# EAGLE design test_baro_24 (EAGLE 6.1)
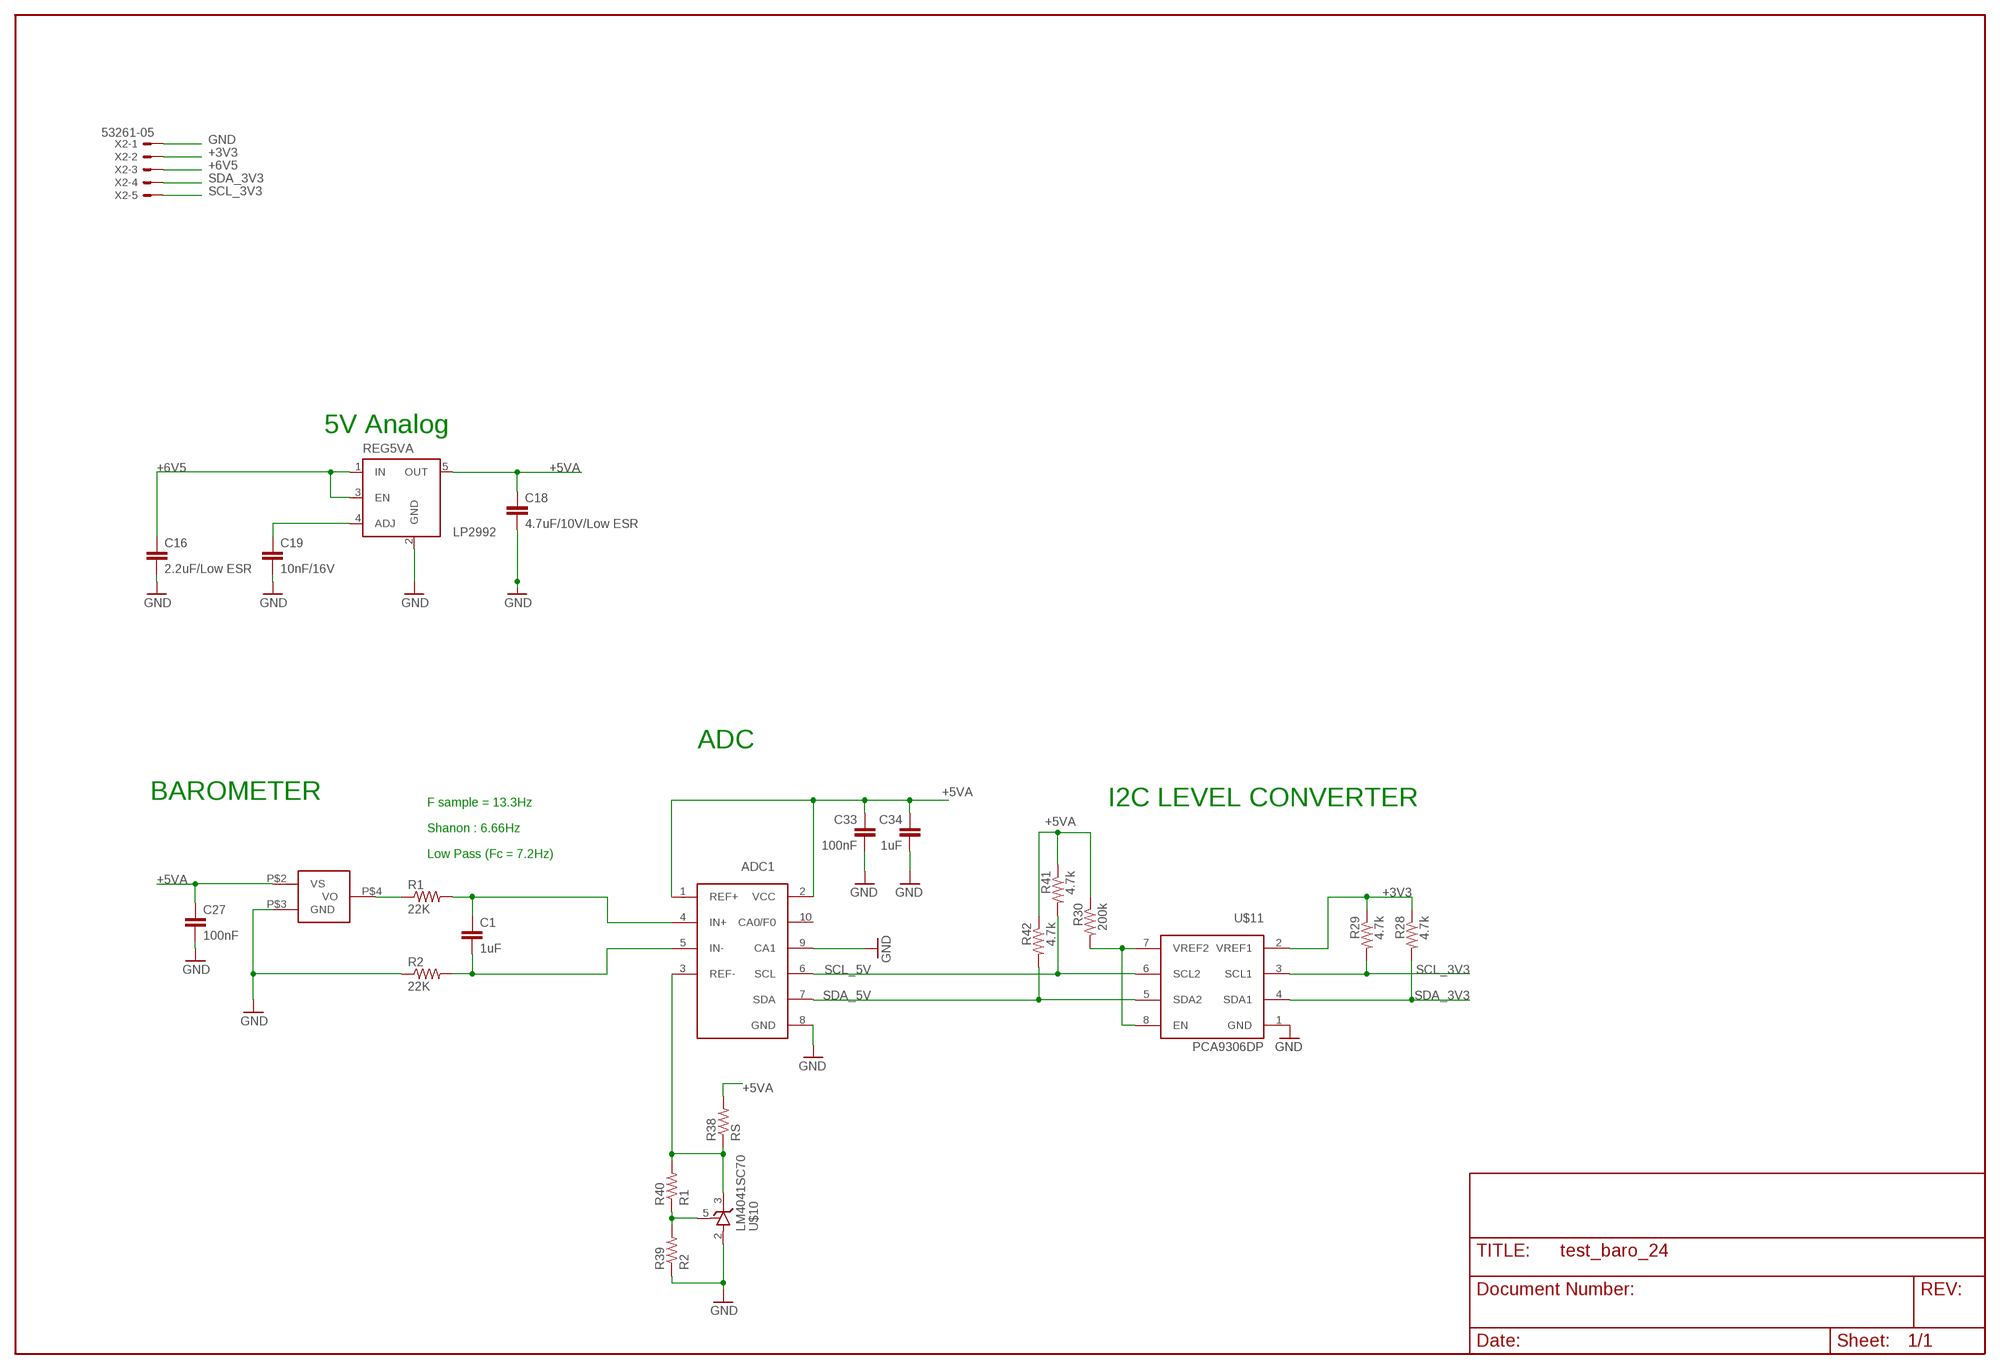
[diagram p0: schematic, sheet 1]

## Parts
ADC1  LTC2485  [DFN10]
C1  1uF  C-EUC1206K  [C1206K]
C16  2.2uF/Low ESR  C-EUC0603  [C0603]
C18  4.7uF/10V/Low ESR  C-EUC0805K  [C0805K]
C19  10nF/16V  C-EUC0603K  [C0603K]
C27  100nF  C-EUC0603  [C0603]
C33  100nF  C-EUC0603  [C0603]
C34  1uF  C-EUC0805  [C0805]
R1  22K  R-US_R0603  [R0603]
R2  22K  R-US_R0603  [R0603]
R28  4.7k  R-US_R0603  [R0603]
R29  4.7k  R-US_R0603  [R0603]
R30  200k  R-US_R0603  [R0603]
R38  RS  R-US_R0603  [R0603]
R39  R2  R-US_R0603  [R0603]
R40  R1  R-US_R0603  [R0603]
R41  4.7k  R-US_R0603  [R0603]
R42  4.7k  R-US_R0603  [R0603]
REG5VA  LP2992  MIC5219BM5  [SOT23-5]
U$2  MPX6115  [CASE_1317]
U$10  LM4041SC70  [SC70-5L]
U$11  PCA9306DP  [TSSOP_B3]
X2  53261-05  [53261-05]

## Nets
+3V3: R28.1 R29.1 U$11.2(VREF1) X2.2
+5VA: ADC1.1(REF+) ADC1.2(VCC) C18.1 C27.1 C33.1 C34.1 R30.1 R38.2 R41.1 R42.1 REG5VA.5(OUT) U$2.P$2(VS)
+6V5: C16.1 REG5VA.1(IN) REG5VA.3(EN) X2.3
GND: ADC1.8(GND) ADC1.9(CA1) C16.2 C18.2 C19.2 C27.2 C33.2 C34.2 R2.1 R39.1 REG5VA.2(GND) U$2.P$3(GND) U$10.2(A) U$11.1(GND) X2.1
N$1: R1.1 U$2.P$4(VO)
N$2: ADC1.4(IN+) C1.1 R1.2
N$4: ADC1.5(IN-) C1.2 R2.2
N$11: R30.2 U$11.7(VREF2) U$11.8(EN)
N$18: R39.2 R40.1 U$10.5(R)
N$23: C19.1 REG5VA.4(ADJ)
N$27: ADC1.3(REF-) R38.1 R40.2 U$10.3(C)
SCL_3V3: R29.2 U$11.3(SCL1) X2.5
SCL_5V: ADC1.6(SCL) R41.2 U$11.6(SCL2)
SDA_3V3: R28.2 U$11.4(SDA1) X2.4
SDA_5V: ADC1.7(SDA) R42.2 U$11.5(SDA2)
Unconnected: ADC1.10(CA0/F0)

## Notes on the sheet
- 5V Analog
- ADC
- BAROMETER
- F sample = 13.3Hz | I2C LEVEL CONVERTER
- Shanon : 6.66Hz
- Low Pass (Fc = 7.2Hz)

## Library data of the parts
ADC1 = booz:LTC2485: 24-Bit ADC With Easy Drive, Input Current Cancellation and I2C Interface
C1 C16 C18 C19 C27 C33 C34 = rcl:C-EU: CAPACITOR, European symbol
R1 R2 R28-R30 R38-R42 = rcl:R-US_: RESISTOR, American symbol
REG5VA = v-reg-micrel:MIC5219BM5: VOLTAGE REGULATOR
U$2 = booz:MPX6115
U$10 = booz:LM4041: Precision Micropower Shunt Voltage Reference
U$11 = booz:PCA9306: Dual bidirectional I2C-bus and SMBus voltage-level translator
X2 = con-molex:53?-05: CONNECTOR wire to board 1.25 mm (.049 inch) pitch header

## Board
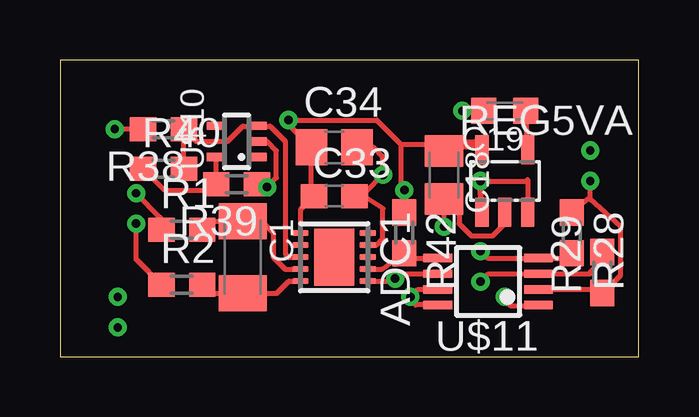
[diagram p1: board, top side]
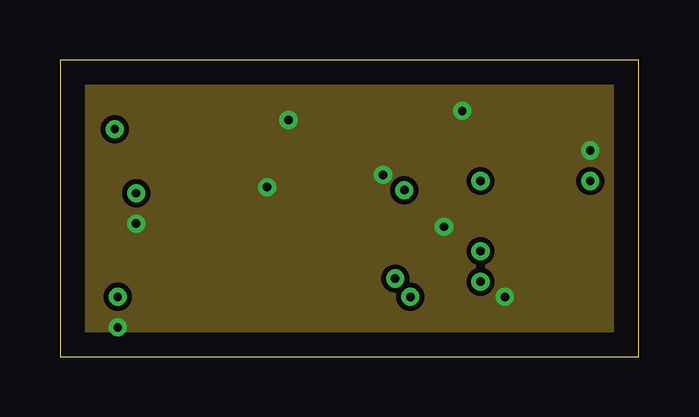
[diagram p2: board, inner layer Route2]
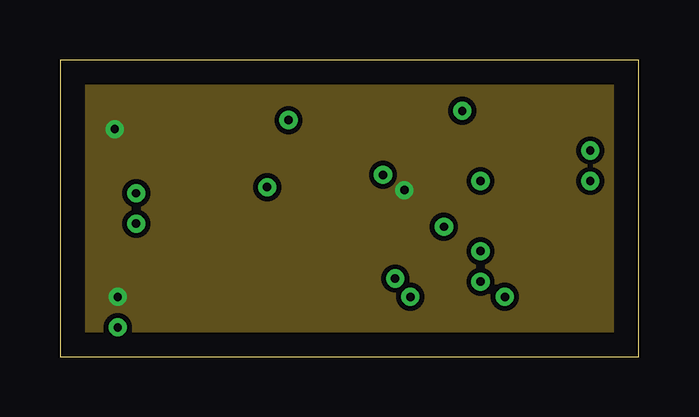
[diagram p3: board, inner layer Route15]
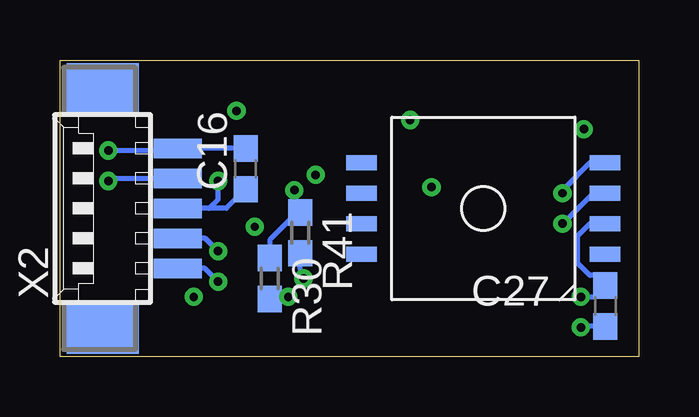
[diagram p4: board, bottom side, seen from below]

Size 24.11 x 12.37 mm. Coordinates in mm from the lower left corner, seen from the top.
Outline: 0,0 24.11,0 24.11,12.37 0,12.37 0,0
Copper layers (1*16): Top 0.035mm / dielectric 1.5mm / Bottom 0.035mm
Design rules: minimum track width 10mil, minimum drill 24mil, track to track 8mil, track to pad 8mil, pad to pad 8mil, via to via 8mil, smd to smd 8mil, copper to edge 40mil, drill to drill 8mil, minimum pad ring 10mil, minimum via ring 8mil, stop-mask expansion 4mil, vias tented up to drill 0mil, thermal gap 10mil

### Footprints (pad centres in the part's own frame; a part is rotated, then mirrored left to right if it is on the bottom)
DFN10 = smd 0.25 x 0.675: 1 -1,-1.4; 2 -0.5,-1.4; 3 0,-1.4; 4 0.5,-1.4; 5 1,-1.4; 6 1,1.4; 7 0.5,1.4; 8 0,1.4; 9 -0.5,1.4; 10 -1,1.4 | smd 2.38 x 1.65: 11 0,0
C1206K = smd 1.5 x 2: 1 -1.5,0; 2 1.5,0
C0603 = smd 1.1 x 1: 1 -0.85,0; 2 0.85,0
C0805K = smd 1.3 x 1.6: 1 -1,0; 2 1,0
C0603K = smd 1.05 x 1.08: 1 -0.875,0; 2 0.875,0
C0805 = smd 1.3 x 1.5: 1 -0.95,0; 2 0.95,0
R0603 = smd 1.1 x 1: 1 -0.85,0; 2 0.85,0
SOT23-5 = smd 0.55 x 1.2: 1 -0.95,-1.3; 2 0,-1.3; 3 0.95,-1.3; 4 0.95,1.3; 5 -0.95,1.3
CASE_1317 = smd 1.27 x 0.635: P$1 5.08,-1.905; P$2 5.08,-0.635; P$3 5.08,0.635; P$4 5.08,1.905; P$5 -5.08,1.905; P$6 -5.08,0.635; P$7 -5.08,-0.635; P$8 -5.08,-1.905
SC70-5L = smd 0.35 x 0.8: 1 -0.65,-0.85; 2 0,-0.85; 3 0.65,-0.85; 4 0.65,0.85; 5 -0.65,0.85
TSSOP_B3 = smd 1.2 x 0.35: 1 -2.925,0.975; 2 -2.925,0.325; 3 -2.925,-0.325; 4 -2.925,-0.975; 5 1.275,-0.975; 6 1.275,-0.325; 7 1.275,0.325; 8 1.275,0.975
53261-05 = smd 0.8 x 2: 1 2.5,-2.5; 2 1.25,-2.5; 3 0,-2.5; 4 -1.25,-2.5; 5 -2.5,-2.5 | smd 2.1 x 3: S1 5,0.625; S2 -5,0.625

### Placement (x,y rotation side)
ADC1  11.43,4.15 270 top
C1  7.62,4.15 270 top
C16  16.38,7.84 90 bottom
C18  16,7.58 270 top
C19  18.54,10.25 180 top
C27  1.39,2.12 270 bottom
C33  11.43,6.69 0 top
C34  11.43,8.73 0 top
R1  5.08,5.3 0 top
R2  5.08,3.01 0 top
R28  21.33,5.17 270 top
R29  22.6,3.52 90 top
R30  15.36,3.26 270 bottom
R38  4.31,9.49 180 top
R39  7.36,7.2 180 top
R40  4.31,7.84 0 top
R41  14.09,5.17 270 bottom
R42  14.35,5.17 270 top
REG5VA  18.54,7.33 0 top
U$2  6.47,6.18 0 bottom
U$10  7.36,8.98 90 top
U$11  17.01,3.14 180 top
X2  21.71,6.18 90 bottom

### Tracks (layer width: path | path; a pad name or v marks a point on that pad's centre or on a via)
+3V3  (via drill 0.35)
  Top 0.203: 22.09,6.65 v22.09,7.33 | 22.09,6.65 R28.1 | 22.09,6.65 22.09,6.57 23.36,5.42 23.36,3.39 22.47,2.5 R29.1 22.35,2.59 22.22,2.76 22.78,2.81 U$11.2
  Bottom 0.203: X2.2 21.99,7.43 v22.09,7.33
+5VA  (via drill 0.35)
  Top 0.203: ADC1.2 ADC1.1 10.03,6.14 C33.1 10.47,6.79 C34.1 9.55,9.65 9.52,9.87 13.2,9.87 14.2,8.87 | R42.1 v14.35,6.95 14.2,6.96 14.2,8.87 | 14.2,8.87 16.65,8.87 | R38.2 v2.28,9.49
  Top 0.406: REG5VA.5 17.58,8.92 17.14,8.85 16.65,8.87 C18.1
  Bottom 0.203: R30.1 15.36,4.88 14.22,6.02 v14.35,6.95 14.35,6.27 R41.1 | U$2.P$2 2.03,5.55 2.54,5.04 2.54,3.9 2.03,3.39 1.81,3.39 C27.1 1.86,2.5 v2.41,2.5
  pour Route15: 0.12,12.28 24,12.28 24,0.09 0.12,0.09
+6V5  (via drill 0.35)
  Top 0.203: REG5VA.3 19.49,7.39 19.43,7.33 17.77,7.33 17.46,7.26 REG5VA.1 17.52,6.09 v17.52,7.33
  Bottom 0.203: 17.9,6.18 X2.3 | 17.9,6.18 17.52,6.57 v17.52,7.33 | C16.1 17.18,6.18 17.9,6.18
GND  (via drill 0.35)
  Top 0.203: C34.2 13.08,8.73 13.46,8.34 v13.46,7.58 12.76,6.88 | C33.2 12.57,6.69 12.76,6.88 | 12.76,6.88 12.76,6.63 13.46,6.18 13.46,4.92 13.2,4.65 ADC1.9 ADC1.8 | v16,5.42 C18.2 16.63,5.95 16.63,5.55 17.14,5.04 18.03,5.04 18.54,5.55 REG5VA.2 | U$11.1 19.93,2.12 18.79,2.12 18.67,2.24 v18.54,2.5 | v3.17,5.55 3.17,4.06 R2.1 | C19.2 v16.76,10.25 | U$10.2 8.63,8.98 9.01,8.6 9.01,7.45 8.76,7.2 R39.1 8.63,6.78 v8.63,7.07
  Bottom 0.203: v3.17,5.55 1.9,6.82 U$2.P$3 | C16.2 X2.1 19.55,8.6 v22.09,8.6 | C27.2 2.37,1.27 v2.41,1.23
  other vias: 9.52,9.87
  pour Route2: 0.25,12.15 24,12.15 24,0.09 0.25,0.09
N$1  (via drill 0.35)
  Top 0.203: v3.17,6.82 4.19,5.8 R1.1
  Bottom 0.203: v3.17,6.82 3.17,6.95 2.03,8.09 U$2.P$4
N$2
  Top 0.203: ADC1.4 9.38,3.65 8.88,4.15 8.88,5.17 8.5,5.55 7.97,5.55 C1.1 6.28,5.65 R1.2
N$4
  Top 0.203: ADC1.5 9.54,3.15 9.04,2.65 C1.2 6.28,2.65 R2.2
N$11  (via drill 0.35)
  Top 0.203: U$11.8 14.81,2.16 v14.6,2.5 14.91,2.81 U$11.7
  Bottom 0.203: R30.2 15.27,2.5 v14.6,2.5
N$18
  Top 0.203: R40.1 4.35,6.95 6.51,6.95 R39.2 U$10.5
N$23
  Top 0.203: REG5VA.4 19.46,8.73 C19.1
N$27
  Top 0.203: ADC1.3 9.52,4.15 9.39,4.28 9.39,8.98 8.76,9.61 8.23,9.61 U$10.3 8.2,9.61 7.62,9.61 6.98,8.98 5.67,8.98 R38.1 R40.2
SCL_3V3  (via drill 0.35)
  Top 0.203: R29.2 22.73,4.15 22.09,3.52 22.08,3.46 U$11.3 17.85,3.46 v17.52,3.14
  Bottom 0.203: X2.5 18.07,3.68 v17.52,3.14
SCL_5V  (via drill 0.35)
  Top 0.203: U$11.6 14.42,3.46 v13.97,3.26 14.11,3.15 ADC1.6
  Bottom 0.203: v13.97,3.26 14.22,4.15 14.09,4.28 R41.2
SDA_3V3  (via drill 0.35)
  Top 0.203: R28.2 21.08,4.11 U$11.4 17.82,4.11 v17.52,4.41
  Bottom 0.203: v17.52,4.41 18.05,4.93 X2.4
SDA_5V
  Top 0.203: ADC1.7 13.43,3.65 R42.2 14.3,4.11 U$11.5